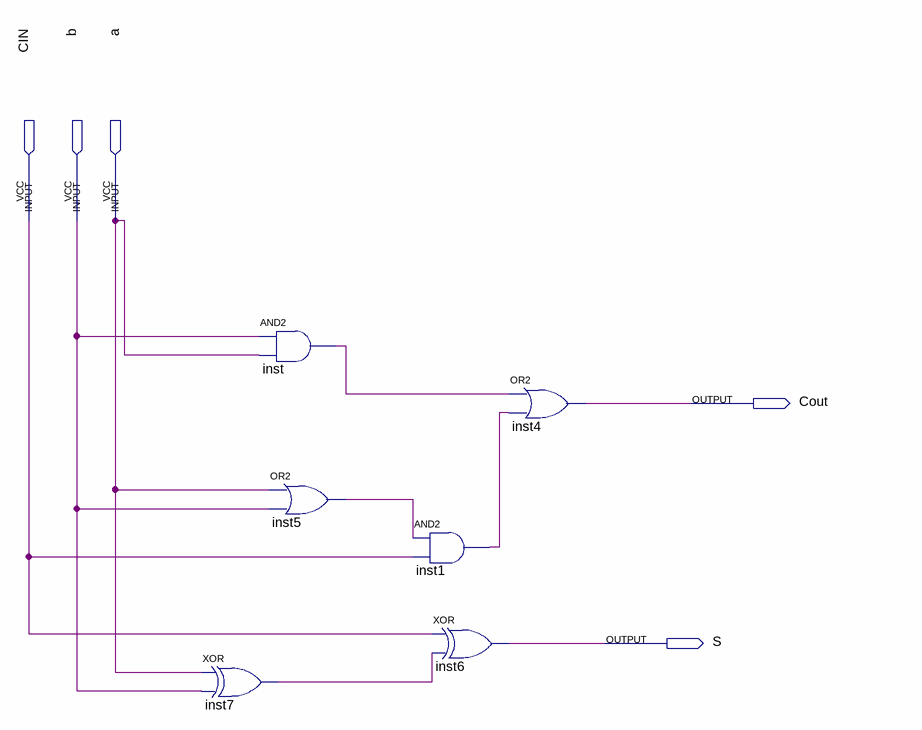
[diagram p0: schematic sheet]
// Quartus schematic FullAdder.bdf as structural Verilog: 6 symbols, 5 pins
module FullAdder (
  input  CIN,
  input  b,
  input  a,
  output Cout,
  output S
);

  wire inst1_out, inst5_out, inst7_out, inst_out;

  xor inst7 (inst7_out, a, b);
  and inst (inst_out, b, a);
  or inst5 (inst5_out, a, b);
  and inst1 (inst1_out, inst5_out, CIN);
  xor inst6 (S, CIN, inst7_out);
  or inst4 (Cout, inst_out, inst1_out);
endmodule
